# Altium schematic sheet INPUT_LOGIC.SchDoc: Input logic
size 297 x 209 mm; CheckedBy: -; CompanyName: CERN; Organization: CERN; Address1: European Organization for Nuclear Research; Address2: CH-1211 Geneve 23 - Switzerland; DocumentNumber: 5; Revision: -; SheetNumber: 6; SheetTotal: 9; EDA_Number: EDA-XXXXX-VX-X; Projet: FMC Delay 1ns 4cha; ModifiedBy: -; CheckedDate: -; Title2: -; DivGrp: BE-CO; Designer: GK; ModifiedDate: -
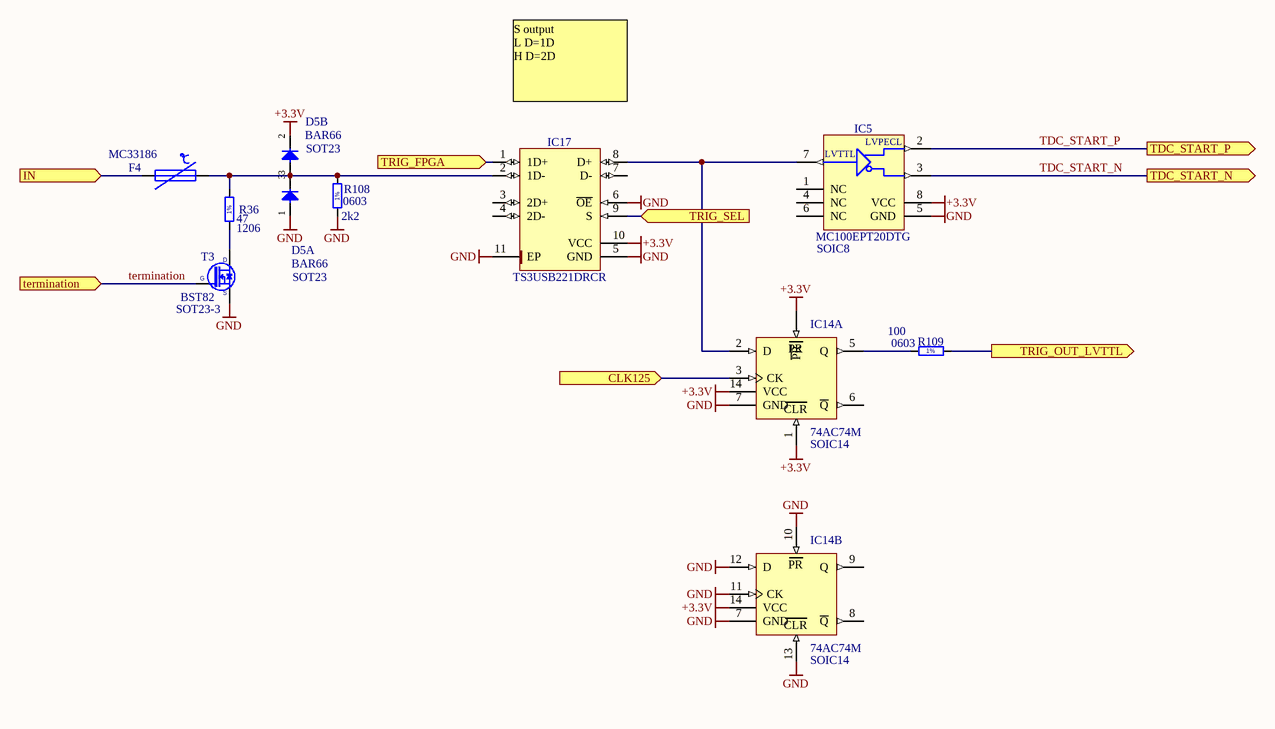
[diagram p0: INPUT_LOGIC.SchDoc]

## Parts
D5  BAR66  Case: SOT23  [SOT95P240X110-3N]  (parts A,B of 2)
F4  MC33186  [PTC_MC33186]
IC5  MC100EPT20DTG  Case: SOIC8  [SOP65P490X110-8N]
IC14  74AC74M  Case: SOIC14  [SOIC127P600X175-14N]  (parts A,B of 2)
IC17  TS3USB221DRCR  [SON50P300X300X100-11N-R175X250]
R36  47  Case: 1206  [RESC3216X65N]
R108  2k2  Case: 0603  [RESC1608X55N]
R109  100  Case: 0603  [RESC1608X55N]
T3  BST82  Case: SOT23-3  [SOT95P240X110-3N]

## Ports
CLK125 (in), IN (in), TDC_START_N (out), TDC_START_P (out), termination (in), TRIG_FPGA (in), TRIG_OUT_LVTTL (out), TRIG_SEL (in)

## Nets
+3.3V: D5.2(C) IC5.8(VCC) IC14.1(~{CLR}) IC14.4(~{PR}) IC14.14(VCC) IC17.10(VCC)  [also labelled VCC]
GND: D5.1(A) IC5.5(GND) IC14.7(GND) IC14.10(~{PR}) IC14.11(CK) IC14.12(D) IC14.13(~{CLR}) IC17.5(GND) IC17.6(~{OE}) IC17.11(EP) R108.1 T3.2(S)
CLK125: IC14.3(CK) ; port CLK125
IN: F4.1 ; port IN
TDC_START_N: IC5.3(~{Q}) ; port TDC_START_N
TDC_START_P: IC5.2(Q) ; port TDC_START_P
termination: T3.1(G) ; port termination
TRIG_FPGA: IC17.1(1D+) ; port TRIG_FPGA
TRIG_OUT_LVTTL: R109.2 ; port TRIG_OUT_LVTTL
TRIG_SEL: IC17.9(S) ; port TRIG_SEL
NetD5_3: D5.3(COMAC) F4.2 IC17.2(1D-) R36.2 R108.2
NetIC5_7: IC5.7(D) IC14.2(D) IC17.8(D+)
NetIC14_5: IC14.5(Q) R109.1
NetR36_1: R36.1 T3.3(D)

Not connected (* = marked no-connect by the designer): IC5 1(NC) 4(NC) 6(NC); IC14 6(~{Q}) 8(~{Q}) 9(Q); IC17 3(2D+) 4(2D-) 7(D-)

## Notes on the sheet
- S	output
  L	D=1D
  H	D=2D
- Project/Equipment
- Document
- Designer
- Drawn by
- Check.by
- File
- Last Mod.
- Print Date
- Sheet
- Size
- A4
- of
- Rev
- (in symbol 74AC74M, part A) PR; CLR
- (in symbol 74AC74M, part B) PR; CLR
- (in symbol MC100EPT20DTG) LVPECL; LVTTL
- (in symbol R0603_2K2_1%_0.1W_100PPM) 1%
- (in symbol R0603_100R_1%_0.1W_100PPM) 1%
- (in symbol R1206_47R_1%_0.25W_100PPM) 1%

## Library data of the parts
D5 = BAR66: Serial Diode; Part Description: Silicon PIN Diode Array (Series Connected); Manufacturer: INFINEON; Manufacturer Part Number: BAT66; Voltage: 150V; Power: 250mA; Table: Diodes; Part Number: BAR66; Component Kind: Standard; Component Type: Standard; Device: BAR66; PackageDescription: SOT23 3-Leads, Pitch 0.95mm - Body 1.3x2.9mm, IPC Medium Density; Pin Count: 3; Mounted: Yes; Socket: No; SMD: Yes; ComponentHeight: 1.1mm; HelpURL: \\cern.ch\dfs\Applications\Altium\Datasheets\BAT66.pdf; Author: CERN DEM JLC; CreateDate: 18.01.2010; LatestRevisionDate: 18.01.2010
F4 = F_POLYSWITCH_0.1A: polymer FUSE Multicomp (Farnell)
IC5 = MC100EPT20DTG: 3.3V LVTTL/LVCMOS to Differential LVPECL Translator; Manufacturer: ON SEMICONDUCTOR; Table: Standard Logic; Part Number: MC100EPT20DTG; Component Kind: Standard; Component Type: Standard; Device: MC100EPT20DTG; PackageDescription: SOP, 0.65mm pitch; 8 pin, 3.00mm W X 3.00mm L X 1.10mm H body, IPC Medium Density; Part Description: 3.3V LVTTL/LVCMOS to Differential LVPECL Translator; Manufacturer Part Number: MC100EPT20DTG; Pin Count: 8; Mounted: Yes; Socket: No; SMD: Yes; ComponentHeight: 1.1mm; Author: CERN DEM JLC; HelpURL: \\cern.ch\dfs\Applications\Altium\Datasheets\MC100EPT20DTG.pdf; CreateDate: 2010-07-05; LatestRevisionDate: 2010-07-05
IC14 = 74AC74M: Dual D-Type Flip Flop with Preset and Clear; Manufacturer: ST MICROELECTRONICS; Table: Standard Logic; Part Number: 74AC74M; Component Kind: Standard; Component Type: Standard; Device: 74AC74M; PackageDescription: SOIC 14, Pitch 1.27mm - Body 4x8.75mm, IPC Medium Density; Part Description: Dual D-Type Flip Flop with Preset and Clear; Manufacturer Part Number: 74AC74M; Pin Count: 14; Mounted: Yes; Socket: No; SMD: Yes; ComponentHeight: 1.75mm; Author: CERN DEM JMW; HelpURL: \\cern.ch\dfs\Applications\Altium\Datasheets\74AC74M.pdf; CreateDate: 2008-11-21; LatestRevisionDate: 2008-11-21
IC17 = TS3USB221DRCR: High-Speed USB 2.0 (480-Mbps) 1:2 Multiplexer/Demultiplexer Switch With Single Enable; Manufacturer: TEXAS INSTRUMENTS; Table: Analog & Interface; Part Number: TS3USB221DRCR; Component Kind: Standard; Component Type: Standard; Device: TS3USB221DRCR; PackageDescription: SON, 0.50mm Pitch, 10-pin, 3.00mm W  X 3.00mm L X 1.00mm Height, (w/thermal tab 1.75 X 2.50 mm), IPC Medium Density; Part Description: High-Speed USB 2.0 (480-Mbps) 1:2 Multiplexer/Demultiplexer Switch With Single Enable; Manufacturer Part Number: TS3USB221DRCR; Pin Count: 11; Case: SON10; Mounted: Yes; Socket: No; SMD: Yes; ComponentHeight: 1mm; Author: CERN DEM JLC; HelpURL: \\cern.ch\dfs\Applications\Altium\Datasheets\TS3USB221DRCR.pdf; CreateDate: 2010-08-25; LatestRevisionDate: 2010-08-25
R36 = R1206_47R_1%_0.25W_100PPM: Resistor - 1%; Part Description: General Purpose Thick Film Chip Resistor; Manufacturer: GENERIC; Manufacturer1 Part Number: NRC12F47R0TRF; Power: 0.25W; TC: ±100ppm/°C; Table: Resistors SMD; Part Number: R1206_47R_1%_0.25W_100PPM; Component Kind: Standard; Component Type: Standard; Pin Count: 2; Value: 47; Status: Preferred; Tolerance: ±1%; Manufacturer Part Number: R1206_47R_1%_0.25W_100PPM; Mounted: Yes; Socket: No; SMD: Yes; Manufacturer1 Example: NIC COMPONENT; Manufacturer1 ComponentHeight: 0.65mm; HelpURL: \\cern.ch\dfs\Applications\Altium\Datasheets\R1206_NIC_NRC.pdf; Author: CERN DEM JLC; CreateDate: 2007-12-03; LatestRevisionDate: 2008-03-13
R108 = R0603_2K2_1%_0.1W_100PPM: Resistor - 1%; Part Description: General Purpose Thick Film Chip Resistor; Manufacturer: GENERIC; Manufacturer1 Part Number: NRC06F2201TRF; Power: 0.1W; TC: ±100ppm/°C; Table: Resistors SMD; Part Number: R0603_2K2_1%_0.1W_100PPM; Component Kind: Standard; Component Type: Standard; Pin Count: 2; Value: 2k2; Status: Preferred; Tolerance: ±1%; Manufacturer Part Number: R0603_2K2_1%_0.1W_100PPM; Mounted: Yes; Socket: No; SMD: Yes; Manufacturer1 Example: NIC COMPONENT; Manufacturer1 ComponentHeight: 0.55mm; HelpURL: \\cern.ch\dfs\Applications\Altium\Datasheets\R0603_NIC_NRC.pdf; Author: CERN DEM JLC; CreateDate: 2007-12-03; LatestRevisionDate: 2008-03-13
R109 = R0603_100R_1%_0.1W_100PPM: Resistor - 1%; Part Description: General Purpose Thick Film Chip Resistor; Manufacturer: GENERIC; Manufacturer1 Part Number: NRC06F4700TRF; Power: 0.1W; TC: ±100ppm/°C; Table: Resistors SMD; Part Number: R0603_100R_1%_0.1W_100PPM; Component Kind: Standard; Component Type: Standard; Pin Count: 2; Value: 100; Status: Preferred; Tolerance: ±1%; Manufacturer Part Number: R0603_100R_1%_0.1W_100PPM; Mounted: Yes; Socket: No; SMD: Yes; Manufacturer1 Example: NIC COMPONENT; Manufacturer1 ComponentHeight: 0.55mm; HelpURL: \\cern.ch\dfs\Applications\Altium\Datasheets\R0603_NIC_NRC.pdf; Author: CERN DEM JLC; CreateDate: 2007-12-03; LatestRevisionDate: 2008-03-13
T3 = BST82: N-CHANNEL MOSFET WITH DIODE; Part Description: 100V 190mA N-Channel Enhancement Mode Field-Effect Transistor; Manufacturer: NXP SEMICONDUCTORS; Table: Transistors; Part Number: BST82; Component Kind: Standard; Component Type: Standard; Device: BST82; PackageDescription: SOT23 3-Leads, Pitch 0.95mm - Body 1.4x3mm, IPC Medium Density; Manufacturer Part Number: BST82; Pin Count: 3; Mounted: Yes; Socket: No; SMD: Yes; ComponentHeight: 1.1mm; HelpURL: \\cern.ch\dfs\Applications\Altium\Datasheets\BST82.pdf; Author: CERN DEM JLC; CreateDate: 2008-05-14; LatestRevisionDate: 2008-05-14